# EAGLE design mixer-board1 (EAGLE 9.6.2)
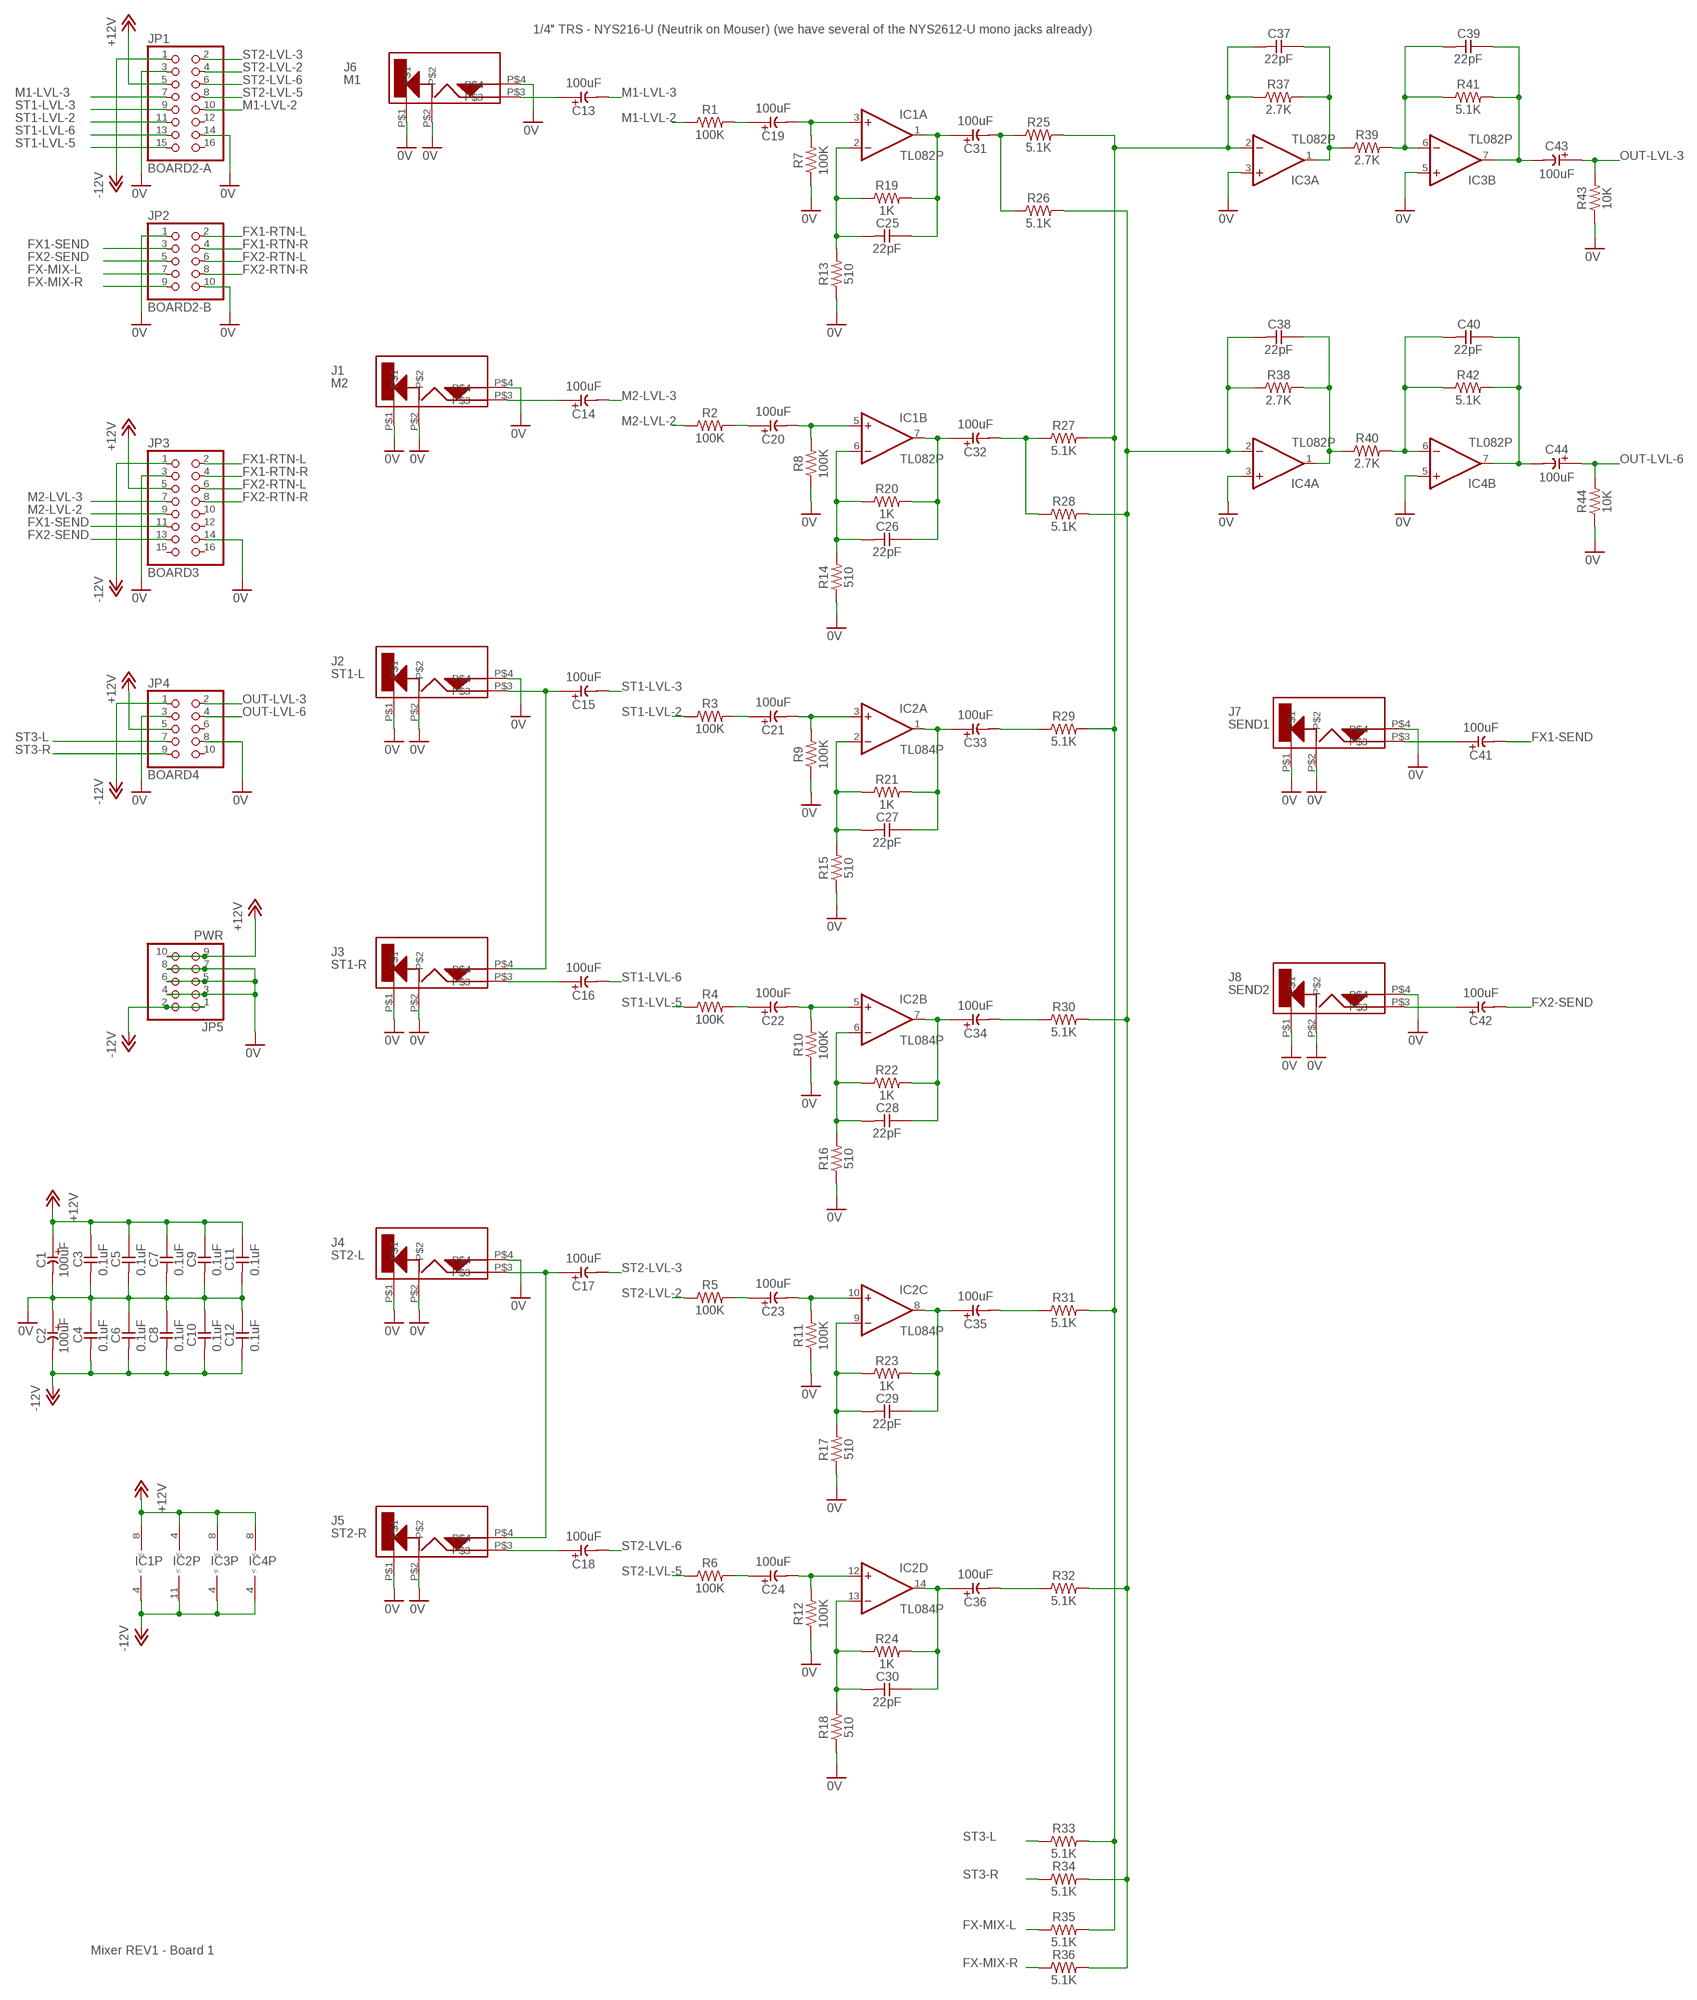
[diagram p0: schematic, sheet 1]

## Parts
C1  100uF  CE-USE5-8.5  [E5-8,5]
C2  100uF  CE-USE5-8.5  [E5-8,5]
C3  0.1uF  CC-US025-024X044  [C025-024X044]
C4  0.1uF  CC-US025-024X044  [C025-024X044]
C5  0.1uF  CC-US025-024X044  [C025-024X044]
C6  0.1uF  CC-US025-024X044  [C025-024X044]
C7  0.1uF  CC-US025-024X044  [C025-024X044]
C8  0.1uF  CC-US025-024X044  [C025-024X044]
C9  0.1uF  CC-US025-024X044  [C025-024X044]
C10  0.1uF  CC-US025-024X044  [C025-024X044]
C11  0.1uF  CC-US025-024X044  [C025-024X044]
C12  0.1uF  CC-US025-024X044  [C025-024X044]
C13  100uF  CE-USE5-8.5  [E5-8,5]
C14  100uF  CE-USE5-8.5  [E5-8,5]
C15  100uF  CE-USE5-8.5  [E5-8,5]
C16  100uF  CE-USE5-8.5  [E5-8,5]
C17  100uF  CE-USE5-8.5  [E5-8,5]
C18  100uF  CE-USE5-8.5  [E5-8,5]
C19  100uF  CE-USE5-8.5  [E5-8,5]
C20  100uF  CE-USE5-8.5  [E5-8,5]
C21  100uF  CE-USE5-8.5  [E5-8,5]
C22  100uF  CE-USE5-8.5  [E5-8,5]
C23  100uF  CE-USE5-8.5  [E5-8,5]
C24  100uF  CE-USE5-8.5  [E5-8,5]
C25  22pF  CC-US025-024X044  [C025-024X044]
C26  22pF  CC-US025-024X044  [C025-024X044]
C27  22pF  CC-US025-024X044  [C025-024X044]
C28  22pF  CC-US025-024X044  [C025-024X044]
C29  22pF  CC-US025-024X044  [C025-024X044]
C30  22pF  CC-US025-024X044  [C025-024X044]
C31  100uF  CE-USE5-8.5  [E5-8,5]
C32  100uF  CE-USE5-8.5  [E5-8,5]
C33  100uF  CE-USE5-8.5  [E5-8,5]
C34  100uF  CE-USE5-8.5  [E5-8,5]
C35  100uF  CE-USE5-8.5  [E5-8,5]
C36  100uF  CE-USE5-8.5  [E5-8,5]
C37  22pF  CC-US025-024X044  [C025-024X044]
C38  22pF  CC-US025-024X044  [C025-024X044]
C39  22pF  CC-US025-024X044  [C025-024X044]
C40  22pF  CC-US025-024X044  [C025-024X044]
C41  100uF  CE-USE5-8.5  [E5-8,5]
C42  100uF  CE-USE5-8.5  [E5-8,5]
C43  100uF  CE-USE5-8.5  [E5-8,5]
C44  100uF  CE-USE5-8.5  [E5-8,5]
IC1  TL082P  [DIL08]
IC2  TL084P  [DIL14]
IC3  TL082P  [DIL08]
IC4  TL082P  [DIL08]
J1  M2  CL1384  [CL1384]
J2  ST1-L  CL1384  [CL1384]
J3  ST1-R  CL1384  [CL1384]
J4  ST2-L  CL1384  [CL1384]
J5  ST2-R  CL1384  [CL1384]
J6  M1  CL1384  [CL1384]
J7  SEND1  CL1384  [CL1384]
J8  SEND2  CL1384  [CL1384]
JP1  BOARD2-A  PINHD-2X8  [2X08]
JP2  BOARD2-B  PINHD-2X5  [2X05]
JP3  BOARD3  PINHD-2X8  [2X08]
JP4  BOARD4  PINHD-2X5  [2X05]
JP5  PWR  PINHD-2X5  [2X05]
R1  100K  R  [0207/7]
R2  100K  R  [0207/7]
R3  100K  R  [0207/7]
R4  100K  R  [0207/7]
R5  100K  R  [0207/7]
R6  100K  R  [0207/7]
R7  100K  R  [0207/7]
R8  100K  R  [0207/7]
R9  100K  R  [0207/7]
R10  100K  R  [0207/7]
R11  100K  R  [0207/7]
R12  100K  R  [0207/7]
R13  510  R  [0207/7]
R14  510  R  [0207/7]
R15  510  R  [0207/7]
R16  510  R  [0207/7]
R17  510  R  [0207/7]
R18  510  R  [0207/7]
R19  1K  R  [0207/7]
R20  1K  R  [0207/7]
R21  1K  R  [0207/7]
R22  1K  R  [0207/7]
R23  1K  R  [0207/7]
R24  1K  R  [0207/7]
R25  5.1K  R  [0207/7]
R26  5.1K  R  [0207/7]
R27  5.1K  R  [0207/7]
R28  5.1K  R  [0207/7]
R29  5.1K  R  [0207/7]
R30  5.1K  R  [0207/7]
R31  5.1K  R  [0207/7]
R32  5.1K  R  [0207/7]
R33  5.1K  R  [0207/7]
R34  5.1K  R  [0207/7]
R35  5.1K  R  [0207/7]
R36  5.1K  R  [0207/7]
R37  2.7K  R  [0207/7]
R38  2.7K  R  [0207/7]
R39  2.7K  R  [0207/7]
R40  2.7K  R  [0207/7]
R41  5.1K  R  [0207/7]
R42  5.1K  R  [0207/7]
R43  10K  R  [0207/7]
R44  10K  R  [0207/7]

## Nets
0V [power]: C1.- C2.+ C3.2 C4.1 C5.2 C6.1 C7.2 C8.1 C9.2 C10.1 C11.2 C12.1 IC3.3(A:+IN) IC3.5(B:+IN) IC4.3(A:+IN) IC4.5(B:+IN) J1.P$1 J1.P$2 J1.P$4 J2.P$1 J2.P$2 J2.P$4 J3.P$1 J3.P$2 J4.P$1 J4.P$2 J4.P$4 J5.P$1 J5.P$2 J6.P$1 J6.P$2 J6.P$4 J7.P$1 J7.P$2 J7.P$4 J8.P$1 J8.P$2 J8.P$4 JP1.3 JP1.14 JP2.1 JP2.10 JP3.3 JP3.14 JP4.3 JP4.8 JP5.3 JP5.4 JP5.5 JP5.6 JP5.7 JP5.8 R7.1 R8.1 R9.1 R10.1 R11.1 R12.1 R13.1 R14.1 R15.1 R16.1 R17.1 R18.1 R43.1 R44.1
+12V [power]: C1.+ C3.1 C5.1 C7.1 C9.1 C11.1 IC1.8(P:V+) IC2.4(P:V+) IC3.8(P:V+) IC4.8(P:V+) JP1.5 JP3.5 JP4.5 JP5.9 JP5.10
-12V [power]: C2.- C4.2 C6.2 C8.2 C10.2 C12.2 IC1.4(P:V-) IC2.11(P:V-) IC3.4(P:V-) IC4.4(P:V-) JP1.1 JP3.1 JP4.1 JP5.1 JP5.2
FX1-RTN-L: JP2.2 JP3.2
FX1-RTN-R: JP2.4 JP3.4
FX1-SEND: C41.- JP2.3 JP3.11
FX2-RTN-L: JP2.6 JP3.6
FX2-RTN-R: JP2.8 JP3.8
FX2-SEND: C42.- JP2.5 JP3.13
FX-MIX-L: JP2.7 R35.1
FX-MIX-R: JP2.9 R36.1
M1-LVL-2: JP1.10 R1.1
M1-LVL-3: C13.- JP1.7
M2-LVL-2: JP3.9 R2.1
M2-LVL-3: C14.- JP3.7
N$1: C13.+ J6.P$3
N$2: C25.2 IC1.2(A:-IN) R13.2 R19.1
N$3: C19.- IC1.3(A:+IN) R7.2
N$4: C19.+ R1.2
N$5: C25.1 C31.+ IC1.1(A:OUT) R19.2
N$6: C31.- R25.1 R26.1
N$7: C37.2 IC3.2(A:-IN) R25.2 R27.2 R29.2 R31.2 R33.2 R35.2 R37.1
N$8: C37.1 IC3.1(A:OUT) R37.2 R39.1
N$9: C39.2 IC3.6(B:-IN) R39.2 R41.1
N$10: C32.- R27.1 R28.1
N$11: C38.1 IC4.1(A:OUT) R38.2 R40.1
N$12: C40.2 IC4.6(B:-IN) R40.2 R42.1
N$13: C39.1 C43.- IC3.7(B:OUT) R41.2
N$14: C42.+ J8.P$3
N$15: C38.2 IC4.2(A:-IN) R26.2 R28.2 R30.2 R32.2 R34.2 R36.2 R38.1
N$16: C14.+ J1.P$3
N$17: C15.+ J2.P$3 J3.P$4
N$18: C40.1 C44.- IC4.7(B:OUT) R42.2
N$19: C16.+ J3.P$3
N$20: C17.+ J4.P$3 J5.P$4
N$21: C18.+ J5.P$3
N$22: C26.1 C32.+ IC1.7(B:OUT) R20.2
N$23: C26.2 IC1.6(B:-IN) R14.2 R20.1
N$24: C20.- IC1.5(B:+IN) R8.2
N$25: C20.+ R2.2
N$27: C41.+ J7.P$3
N$28: C34.- R30.1
N$29: C33.- R29.1
N$30: C27.1 C33.+ IC2.1(A:OUT) R21.2
N$31: C27.2 IC2.2(A:-IN) R15.2 R21.1
N$32: C21.- IC2.3(A:+IN) R9.2
N$33: C21.+ R3.2
N$35: C28.1 C34.+ IC2.7(B:OUT) R22.2
N$36: C28.2 IC2.6(B:-IN) R16.2 R22.1
N$37: C22.- IC2.5(B:+IN) R10.2
N$38: C22.+ R4.2
N$41: C35.- R31.1
N$42: C29.1 C35.+ IC2.8(C:OUT) R23.2
N$43: C29.2 IC2.9(C:-IN) R17.2 R23.1
N$44: C23.- IC2.10(C:+IN) R11.2
N$45: C23.+ R5.2
N$48: C36.- R32.1
N$49: C30.1 C36.+ IC2.14(D:OUT) R24.2
N$50: C30.2 IC2.13(D:-IN) R18.2 R24.1
N$51: C24.- IC2.12(D:+IN) R12.2
N$52: C24.+ R6.2
OUT-LVL-3: C43.+ JP4.2 R43.2
OUT-LVL-6: C44.+ JP4.4 R44.2
ST1-LVL-2: JP1.11 R3.1
ST1-LVL-3: C15.- JP1.9
ST1-LVL-5: JP1.15 R4.1
ST1-LVL-6: C16.- JP1.13
ST2-LVL-2: JP1.4 R5.1
ST2-LVL-3: C17.- JP1.2
ST2-LVL-5: JP1.8 R6.1
ST2-LVL-6: C18.- JP1.6
ST3-L: JP4.7 R33.1
ST3-R: JP4.9 R34.1
Unconnected: JP1.12 JP1.16 JP3.10 JP3.12 JP3.15 JP3.16 JP4.6 JP4.10

## Notes on the sheet
- 1/4" TRS - NYS216-U (Neutrik on Mouser) (we have several of the NYS2612-U mono jacks already)
- Mixer REV1 - Board 1

## Library data of the parts
C1 C2 C13-C24 C31-C36 C41-C44 = _common:CE-US: ELECTROLYTIC CAPACITOR, US symbol
C3-C12 = _common.v1:CC-US: CAPACITOR, US symbol
C25-C30 C37-C40 = _common:CC-US: CAPACITOR, US symbol
IC1 IC3 IC4 = _common:TL082: OP AMP
IC2 = _common:TL084: OP AMP
J1-J8 = jacks:CL1384
JP1 JP3 = pinhead:PINHD-2X8: PIN HEADER
JP2 JP4 JP5 = pinhead:PINHD-2X5: PIN HEADER
R1-R44 = _common:R: RESISTOR, US symbol

## Net classes
0 default: width 0.305 mm, clearance 0.305 mm
1 power: width 0.711 mm, clearance 0.305 mm

## Board
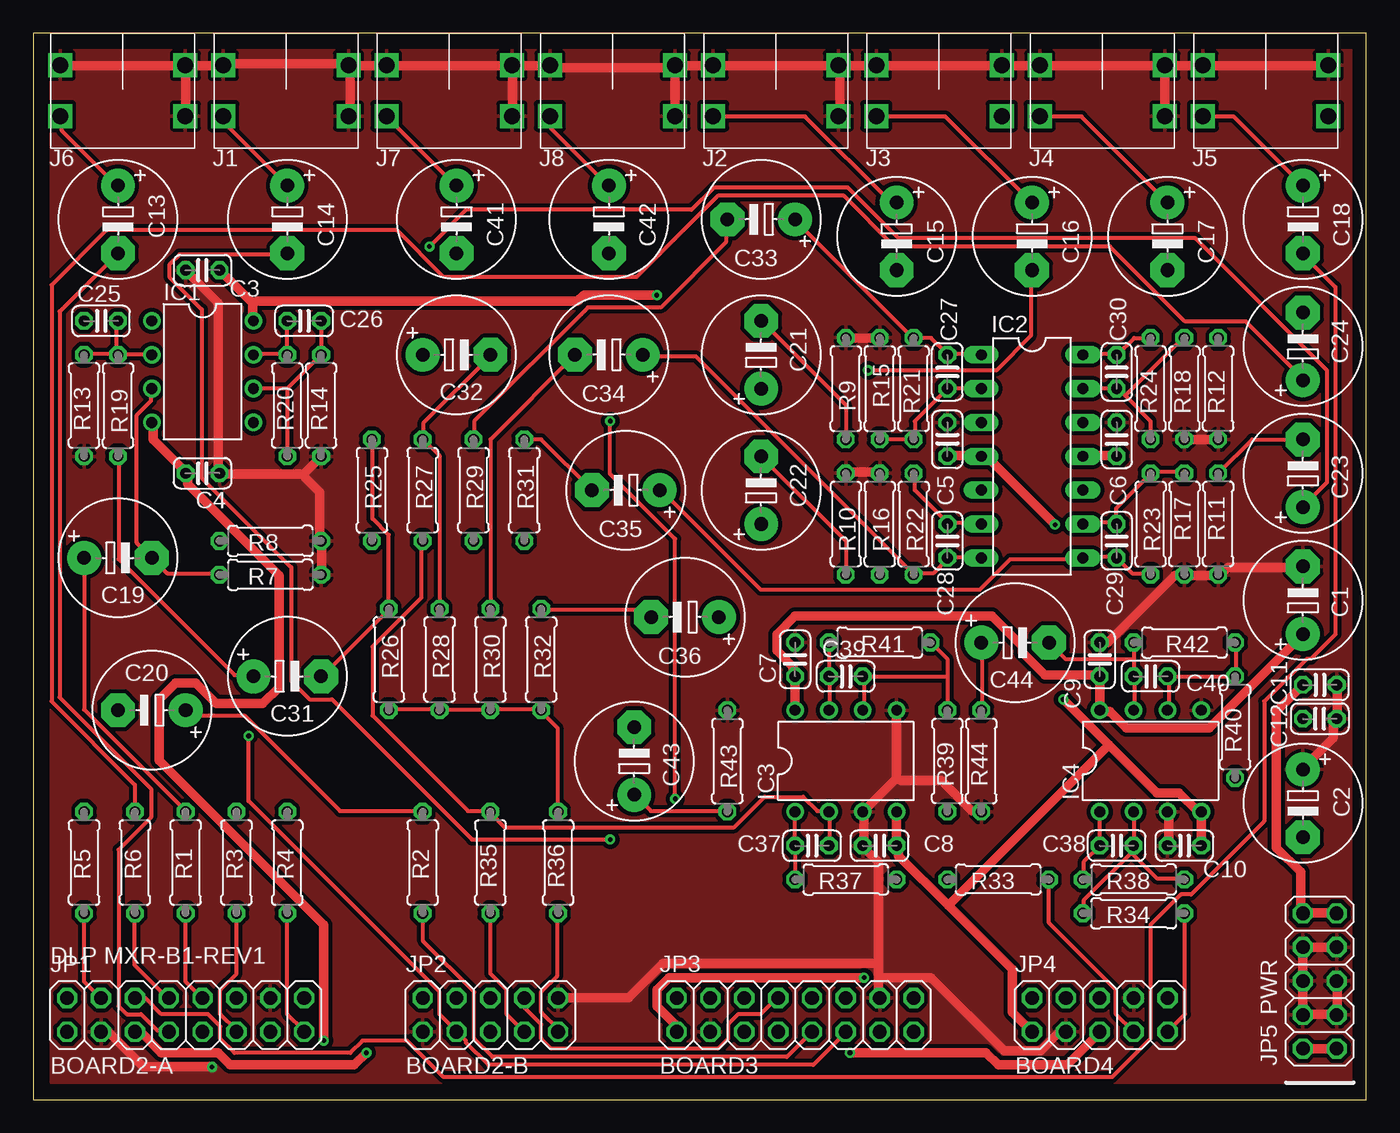
[diagram p1: board, top side]
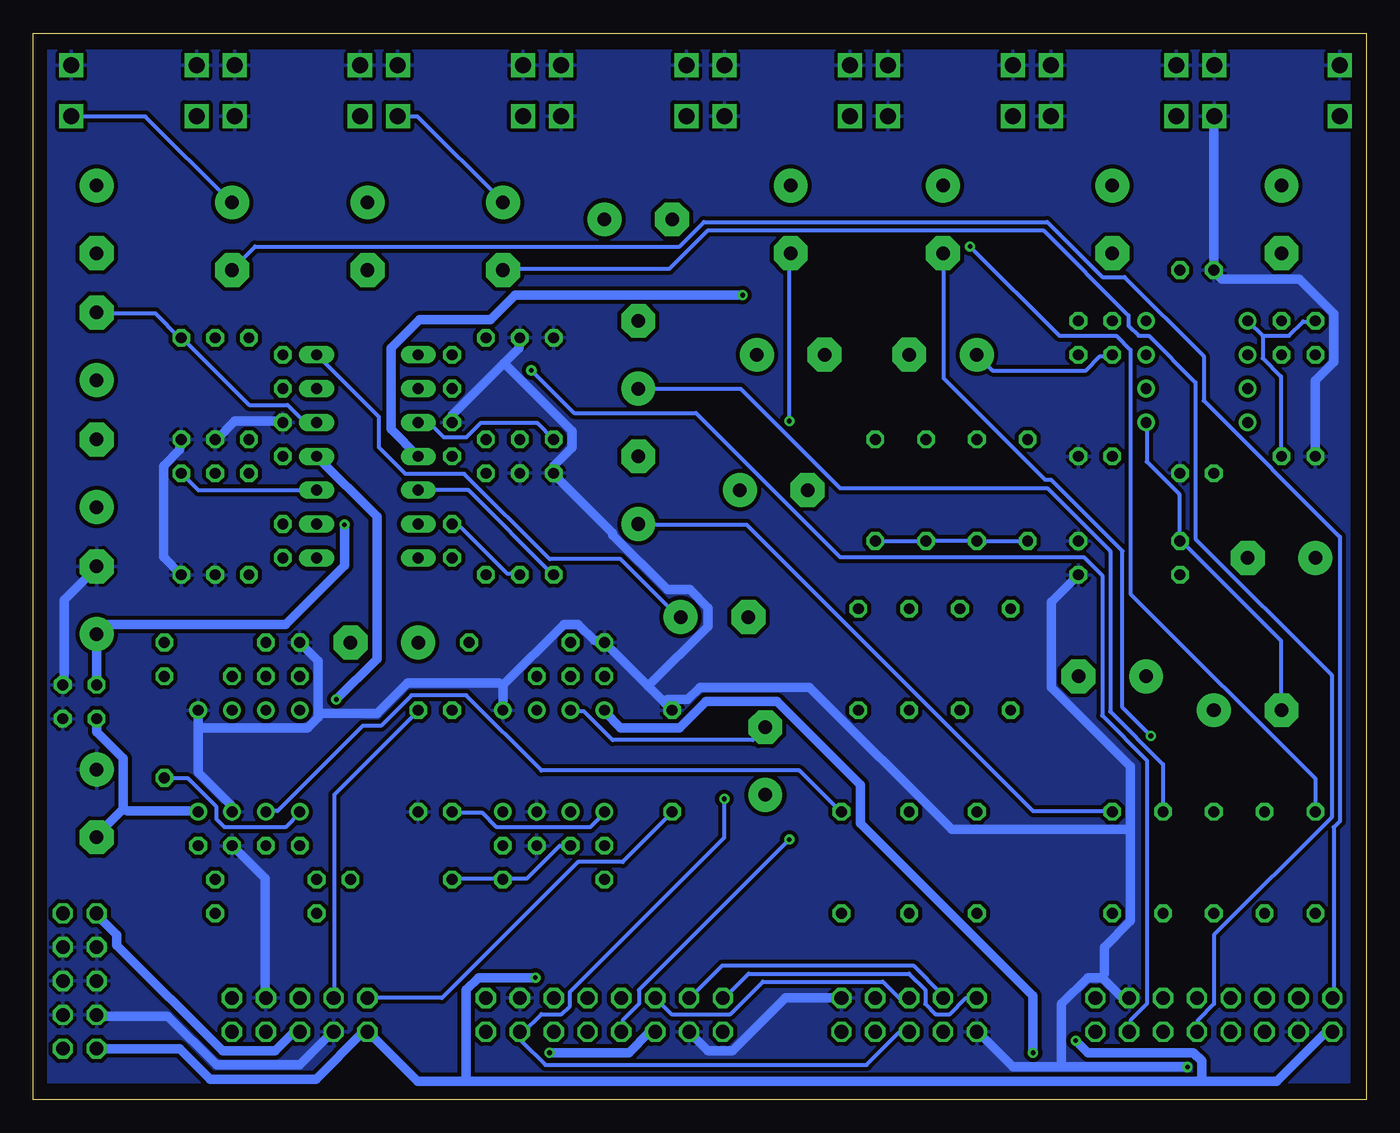
[diagram p2: board, bottom side, seen from below]

Size 100 x 80 mm. Coordinates in mm from the lower left corner, seen from the top.
Outline: 0,0 100,0 100,80 0,80 0,0
Copper layers (1*16): Top 0.035mm / dielectric 1.5mm / Bottom 0.035mm
Design rules "default": minimum track width 6mil, minimum drill 0.35mm, track to track 6mil, track to pad 6mil, pad to pad 6mil, via to via 6mil, smd to smd 6mil, copper to edge 40mil, drill to drill 6mil, minimum pad ring 10mil, minimum via ring 8mil, stop-mask expansion 4mil, vias tented up to drill 0mil, thermal gap 10mil

### Footprints (pad centres in the part's own frame; a part is rotated, then mirrored left to right if it is on the bottom)
E5-8,5 = drill 1.016 pad 2.54: + -2.54,0 | drill 1.016 pad 2.54 octagon: - 2.54,0
C025-024X044 = drill 0.813 octagon: 1 -1.27,0; 2 1.27,0
DIL08 = drill 0.813 pad 1.27: 1 -3.81,-3.81; 2 -1.27,-3.81; 3 1.27,-3.81; 4 3.81,-3.81; 5 3.81,3.81; 6 1.27,3.81; 7 -1.27,3.81; 8 -3.81,3.81
DIL14 = drill 0.813 long: 1 -7.62,-3.81; 2 -5.08,-3.81; 3 -2.54,-3.81; 4 0,-3.81; 5 2.54,-3.81; 6 5.08,-3.81; 7 7.62,-3.81; 8 7.62,3.81; 9 5.08,3.81; 10 2.54,3.81; 11 0,3.81; 12 -2.54,3.81; 13 -5.08,3.81; 14 -7.62,3.81
CL1384 = drill 1.2 square: P$1 0,0; P$2 9.4,0; P$3 0,-3.8; P$4 9.4,-3.8
2X08 = drill 1.016 octagon: 1 -8.89,-1.27; 2 -8.89,1.27; 3 -6.35,-1.27; 4 -6.35,1.27; 5 -3.81,-1.27; 6 -3.81,1.27; 7 -1.27,-1.27; 8 -1.27,1.27; 9 1.27,-1.27; 10 1.27,1.27; 11 3.81,-1.27; 12 3.81,1.27; 13 6.35,-1.27; 14 6.35,1.27; 15 8.89,-1.27; 16 8.89,1.27
2X05 = drill 1.016 octagon: 1 -5.08,-1.27; 2 -5.08,1.27; 3 -2.54,-1.27; 4 -2.54,1.27; 5 0,-1.27; 6 0,1.27; 7 2.54,-1.27; 8 2.54,1.27; 9 5.08,-1.27; 10 5.08,1.27
0207/7 = drill 0.813 octagon: 1 -3.81,0; 2 3.81,0

### Placement (x,y rotation side)
C1  95.25,37.47 90 top
C2  95.25,22.23 270 top
C3  12.7,62.23 180 top
C4  12.7,46.99 180 top
C5  68.58,49.53 90 top
C6  81.28,49.53 270 top
C7  57.15,33.02 90 top
C8  63.5,19.05 0 top
C9  80.01,33.02 90 top
C10  86.36,19.05 0 top
C11  96.52,31.11 0 top
C12  96.52,28.57 180 top
C13  6.35,66.04 270 top
C14  19.05,66.04 270 top
C15  64.77,64.77 270 top
C16  74.93,64.77 270 top
C17  85.09,64.77 270 top
C18  95.25,66.04 270 top
C19  6.35,40.64 0 top
C20  8.89,29.21 180 top
C21  54.61,55.88 90 top
C22  54.61,45.72 90 top
C23  95.25,46.99 90 top
C24  95.25,56.52 90 top
C25  5.08,58.42 0 top
C26  20.32,58.42 0 top
C27  68.58,54.61 270 top
C28  68.58,41.91 90 top
C29  81.28,41.91 90 top
C30  81.28,54.61 270 top
C31  19.05,31.75 0 top
C32  31.75,55.88 0 top
C33  54.61,66.04 180 top
C34  43.18,55.88 180 top
C35  44.45,45.72 180 top
C36  48.9,36.2 180 top
C37  58.42,19.05 0 top
C38  81.28,19.05 0 top
C39  60.96,31.75 0 top
C40  83.82,31.75 0 top
C41  31.75,66.04 270 top
C42  43.18,66.04 270 top
C43  45.09,25.4 90 top
C44  73.66,34.29 0 top
IC1  12.7,54.61 270 top
IC2  74.93,48.26 270 top
IC3  60.96,25.4 0 top
IC4  83.82,25.4 0 top
J1  14.25,77.6 0 top
J2  51,77.6 0 top
J3  63.25,77.6 0 top
J4  75.5,77.6 0 top
J5  87.75,77.6 0 top
J6  2,77.6 0 top
J7  26.5,77.6 0 top
J8  38.75,77.6 0 top
JP1  11.43,6.35 0 top
JP2  34.29,6.35 0 top
JP3  57.15,6.35 0 top
JP4  80.01,6.35 0 top
JP5  96.52,8.89 90 top
R1  11.43,17.78 90 top
R2  29.21,17.78 90 top
R3  15.24,17.78 90 top
R4  19.05,17.78 90 top
R5  3.81,17.78 90 top
R6  7.62,17.78 90 top
R7  17.78,39.37 180 top
R8  17.78,41.91 180 top
R9  60.96,53.34 270 top
R10  60.96,43.18 270 top
R11  88.9,43.18 90 top
R12  88.9,53.34 90 top
R13  3.81,52.07 90 top
R14  21.59,52.07 90 top
R15  63.5,53.34 270 top
R16  63.5,43.18 270 top
R17  86.36,43.18 90 top
R18  86.36,53.34 90 top
R19  6.35,52.07 270 top
R20  19.05,52.07 90 top
R21  66.04,53.34 90 top
R22  66.04,43.18 270 top
R23  83.82,43.18 270 top
R24  83.82,53.34 90 top
R25  25.4,45.72 270 top
R26  26.67,33.02 270 top
R27  29.21,45.72 270 top
R28  30.48,33.02 270 top
R29  33.02,45.72 270 top
R30  34.29,33.02 270 top
R31  36.83,45.72 270 top
R32  38.1,33.02 270 top
R33  72.39,16.51 180 top
R34  82.55,13.97 180 top
R35  34.29,17.78 90 top
R36  39.37,17.78 90 top
R37  60.96,16.51 180 top
R38  82.55,16.51 180 top
R39  68.58,25.4 90 top
R40  90.17,27.94 90 top
R41  63.5,34.29 180 top
R42  86.36,34.29 180 top
R43  52.07,25.4 270 top
R44  71.12,25.4 90 top

### Tracks (layer width: path | path; a pad name or v marks a point on that pad's centre or on a via)
0V  (via drill 0.35)
  Top 0.711: C10.1 85.19,19.05 85.19,21.49 IC4.3 | C11.2 97.84,31.09 97.84,28.65 C12.1 97.54,28.35 97.54,27.13 95.25,24.84 C2.+ | R12.1 R18.1 | C9.2 80.62,34.29 85.65,39.32 86.26,39.32 R17.1 86.72,39.32 88.85,39.32 R11.1 89.15,39.47 89.61,39.93 95.25,39.93 C1.- | R10.1 60.96,47.09 63.4,47.09 R16.1 | R15.1 R9.1 | JP5.5 97.84,8.84 97.84,6.71 JP5.3 97.69,6.4 95.56,6.4 JP5.4 JP5.6 JP5.8 JP5.7 | 64.77,24.08 IC3.5 | 64.77,24.08 62.48,21.79 IC3.3 62.33,21.49 62.33,19.05 C8.1 62.48,18.75 63.4,17.83 63.4,10.21 | R44.1 71.02,21.64 70.41,21.64 68.12,23.93 65.08,23.93 64.77,24.08 | 63.4,10.21 63.4,9.14 | 63.4,9.14 63.4,7.62 JP3.14 | 63.4,9.14 67.36,9.14 72.85,3.66 75.59,3.66 76.96,5.03 77.42,5.03 JP4.3 | JP2.10 44.65,7.62 47.24,10.21 63.4,10.21 | v13.41,2.44 8.23,2.44 5.64,5.03 5.18,5.03 JP1.3 | R7.1 21.64,39.47 21.64,41.91 R8.1 21.49,42.22 21.49,45.57 20.42,46.63 20.27,46.94 | 20.27,46.94 14.02,46.94 C4.1 13.87,47.24 13.87,59.74 11.43,62.18 C3.2 | R14.1 20.27,46.94 | J4.P$4 84.89,73.91 84.89,77.57 J4.P$2 | J4.P$2 85.19,77.57 87.63,77.57 J5.P$1 88.09,77.57 97.08,77.57 J5.P$2 | J4.P$2 84.58,77.57 75.74,77.57 J4.P$1 75.44,77.57 72.69,77.57 J3.P$2 72.39,77.57 63.55,77.57 J3.P$1 63.25,77.57 60.81,77.57 J2.P$2 | J8.P$4 48.16,73.91 48.16,77.57 J8.P$2 | J8.P$2 48.46,77.57 50.9,77.57 J2.P$1 51.36,77.57 60.05,77.57 J2.P$2 | J2.P$4 60.5,73.91 60.5,77.57 J2.P$2 | J7.P$4 35.97,73.91 35.97,77.57 J7.P$2 | J7.P$2 36.27,77.57 38.71,77.57 J8.P$1 39.01,77.42 47.85,77.42 J8.P$2 | J1.P$4 23.77,73.91 23.77,77.57 J1.P$2 | J1.P$2 24.08,77.57 26.36,77.57 J7.P$1 26.82,77.57 35.66,77.57 J7.P$2 | J6.P$4 11.43,73.91 11.43,77.57 J6.P$2
  Top 0.711: J6.P$1 2.13,77.57 11.12,77.57 J6.P$2 | J6.P$2 11.73,77.57 14.17,77.57 J1.P$1 14.48,77.72 23.32,77.72 J1.P$2
  Bottom 0.711: 87.63,27.89 87.63,24.54 85.19,22.1 85.19,21.64 IC4.3 | 87.63,27.89 IC4.5 | JP4.8 82.6,7.62 82.6,16.61 85.04,19.05 C10.1 | C6.1 81.38,50.9 84.89,50.9 86.26,49.53 R18.1 | R11.1 90.22,40.69 90.22,47.55 89,48.77 89,49.53 R12.1 | C11.2 97.69,31.24 97.69,37.49 95.25,39.93 C1.- | 87.63,27.89 79.4,27.89 78.64,28.65 78.64,28.96 | 78.64,28.96 78.64,32.92 C9.2 | C5.2 68.58,51.36 64.69,55.24 | 64.69,55.24 63.55,56.39 63.55,57.15 R15.1 | 64.69,55.24 59.59,50.14 59.59,48.92 60.96,47.55 R10.1 60.81,46.79 56.54,42.52 56.54,42.37 52.43,38.25 50.75,38.25 49.38,36.88 49.38,35.51 53.87,31.01 | JP2.10 43.59,7.62 47.55,3.66 49.38,3.66 JP3.3 | 53.87,31.01 C7.2 57.45,34.44 57.91,34.44 59.13,35.66 60.2,35.66 64.77,31.09 | 53.87,31.01 52.65,29.79 | 52.65,29.79 R43.1 | JP5.4 95.25,6.25 89.92,6.25 86.26,2.59 80.01,2.59 77.57,5.03 JP4.3 | IC3.5 64.77,31.09 | 78.64,28.96 74.22,28.96 71.93,31.24 65.08,31.24 64.77,31.09 | 22.86,2.44 26.52,2.44 29.11,5.03 JP2.1 | 22.86,2.44 v13.41,2.44 | JP1.14 18.29,7.62 19.81,9.14 | 19.81,9.14 20.88,9.14 22.86,7.16 22.86,2.44 | R13.1 3.81,53.95 2.44,55.32 2.44,58.98 5.03,61.57 10.82,61.57 11.43,62.18 C3.2 11.43,73.76 J6.P$4 | 17.68,20.27 17.68,24.99 23.62,30.94 23.62,37.34 R7.1 | 17.68,20.27 17.68,13.41 19.66,11.43 19.66,9.45 19.81,9.14 | 17.68,20.27 31.09,20.27 41.76,30.94 49.99,30.94 50.9,30.02 52.43,30.02 52.65,29.79
  pour Top: 1.27,1.27 99.06,1.27 99.06,78.74 1.27,78.74
  pour Bottom: 1.27,1.27 99.06,1.27 99.06,78.74 1.27,78.74
+12V  (via drill 0.35)
  Top 0.711: IC3.8 C7.1 57,32 57,32.46 55.78,33.68 55.78,34.9 57.15,36.27 71.93,36.27 74.22,33.98 74.22,33.53 75.89,31.85 79.7,31.85 C9.1 IC4.8 80.31,29.11 80.77,29.11 81.99,27.89 88.24,27.89 95.25,34.9 C1.+ | v24.99,3.5 24.08,2.59 14.78,2.59 13.87,3.5 9.6,3.5 8.08,5.03 7.62,5.03 JP1.5 | v61.27,3.5 71.48,3.5 72.39,2.59 77.57,2.59 80.01,5.03 JP4.5 | 16.46,59.74 16.46,58.52 IC1.8 | C3.1 16.46,59.74 | JP5.9 97.69,14.02 95.25,14.02 JP5.10 95.1,14.33 95.1,17.07 93.27,18.9 93.27,29.11 95.25,31.09 C11.1 | C5.1 68.58,48.31 71.02,48.31 IC2.4 71.48,48.31 v76.66,43.13 | v46.79,60.35 41.3,60.35 40.84,59.89 16.76,59.89 16.46,59.74
  Bottom 0.711: v24.99,3.5 24.99,7.77 37.95,20.73 37.95,23.62 44.2,29.87 49.53,29.87 51.51,27.89 55.93,27.89 57.15,29.11 IC3.8 | v61.27,3.5 55.32,3.5 53.8,5.03 53.34,5.03 JP3.5 | C11.1 C1.+ 94.94,35.05 94.34,35.66 81.08,35.66 76.66,40.08 v76.66,43.13 | v46.79,60.35 63.86,60.35 65.68,58.52 71.02,58.52 73.15,56.39 73.15,50.29 IC2.4 | JP4.5 80.01,5.03 80.47,5.03 81.84,3.66 85.8,3.66 93.73,11.58 93.73,12.34 95.25,13.87 JP5.10
-12V  (via drill 0.35)
  Top 0.711: IC2.11 78.79,48.31 81.23,48.31 C6.2 | C10.2 IC4.4 87.33,21.64 85.95,23.01 84.28,23.01 80.7,26.59 | 80.7,26.59 v77.27,30.02 | IC1.4 8.99,50.75 8.99,49.53 11.43,47.09 C4.2 11.58,46.79 11.58,46.18 18.44,39.32 18.44,30.94 17.22,29.72 13.72,29.72 12.19,31.24 10.67,31.24 9.45,30.02 9.45,25.45 21.79,13.11 v21.79,4.42 | JP5.1 JP5.2 | IC3.4 C8.2 64.92,18.75 64.92,18.29 68.66,14.55 | v62.33,9.14 47.7,9.14 46.79,8.23 46.79,7.01 48.16,5.64 48.16,5.18 JP3.1 | 68.66,14.55 73.46,9.75 73.46,6.55 JP4.1 | 68.66,14.55 80.7,26.59
  Bottom 0.711: C12.2 95.25,27.58 93.27,25.6 93.27,21.79 | 93.27,21.79 95.25,19.81 C2.- | IC4.4 87.63,21.64 92.96,21.64 93.27,21.79 | IC2.11 74.22,43.74 74.22,33.07 v77.27,30.02 | 67.51,1.37 71.17,1.37 74.83,5.03 JP4.1 75.29,5.03 78.79,1.52 86.72,1.52 89,3.81 JP5.2 | 67.51,1.37 12.34,1.37 | 12.34,1.37 6.71,1.37 3.05,5.03 2.59,5.03 JP1.1 | v62.33,9.14 66.6,9.14 67.51,8.23 67.51,1.37 | v21.79,4.42 20.88,3.5 12.95,3.5 12.34,2.9 12.34,1.37
FX1-RTN-L
  Bottom 0.305: JP2.2 30.02,7.62 31.24,6.4 32.31,6.4 33.07,7.16 33.07,8.23 34.29,9.45 46.33,9.45 48.16,7.62 JP3.2
FX1-RTN-R
  Bottom 0.305: JP2.4 31.85,7.62 31.85,7.92 33.98,10.06 48.31,10.06 50.75,7.62 JP3.4
FX1-SEND  (via drill 0.35)
  Top 0.305: JP3.11 60.96,5.03 58.52,2.59 34.14,2.59 32.46,4.27 32.46,4.42 31.85,5.03 JP2.3 31.7,5.18 30.48,6.4 30.48,8.08 16.15,22.4 v16.15,27.28
  Bottom 0.305: v16.15,27.28 18.29,29.41 18.29,41.15 23.62,46.48 24.08,46.48 31.7,54.1 31.7,63.4 C41.-
FX2-RTN-L
  Bottom 0.305: JP2.6 35.05,7.62 36.27,8.84 45.26,8.84 47.7,6.4 52.12,6.4 JP3.6
FX2-RTN-R
  Top 0.305: JP2.8 36.88,7.62 36.88,6.86 38.1,5.64 38.1,4.57 38.86,3.81 51.36,3.81 52.12,4.57 52.12,5.64 52.88,6.4 54.56,6.4 55.78,7.62 JP3.8
FX2-SEND  (via drill 0.35)
  Top 0.305: v43.28,50.9 43.28,46.94 48.16,42.06 v48.16,22.55
  Bottom 0.305: JP2.5 34.29,5.03 35.05,5.03 37.49,2.59 61.57,2.59 63.4,4.42 63.4,5.03 JP3.13 63.25,5.03 61.87,6.4 60.35,6.4 59.74,7.01 59.74,8.08 48.16,19.66 v48.16,22.55 | v43.28,50.9 43.28,63.4 C42.-
FX-MIX-L
  Top 0.305: R35.1 34.29,9.45 35.51,8.23 35.51,6.4 JP2.7
FX-MIX-R
  Top 0.305: R36.1 39.32,13.87 39.32,9.3 38.1,8.08 38.1,6.55 39.47,5.18 JP2.9
M1-LVL-2
  Top 0.305: R1.1 11.43,8.84 12.65,7.62 JP1.10
M1-LVL-3
  Top 0.305: C13.- 1.98,59.13 1.98,30.18 8.84,23.32 8.84,21.18 6.4,18.75 6.4,7.01 7.01,6.4 8.08,6.4 9.3,5.18 10.06,5.18 JP1.7
M2-LVL-2
  Top 0.305: JP3.9 56.54,3.2 34.44,3.2 33.07,4.57 33.07,8.08 29.26,11.89 29.26,13.87 R2.1
M2-LVL-3  (via drill 0.35)
  Top 0.305: v43.28,19.51 32.92,19.51 22.4,30.02 20.73,30.02 19.36,31.39 19.36,39.93 12.65,46.63 12.65,59.28 10.21,61.72 10.21,62.64 10.97,63.4 19.05,63.4 C14.-
  Bottom 0.305: v43.28,19.51 54.56,8.23 54.56,7.16 55.78,5.94 55.78,5.18 JP3.7
N$1
  Top 0.305: J6.P$3 2.13,73.76 2.13,72.69 6.25,68.58 C13.+
N$2
  Top 0.305: R13.2 3.81,55.93 6.25,55.93 R19.1 | IC1.2 8.84,55.93 6.4,55.93 R19.1 | C25.2 6.25,58.37 6.25,56.08 R19.1
N$3
  Top 0.305: R7.2 13.87,39.47 10.06,39.47 C19.- 7.77,41.76 7.77,51.36 8.84,52.43 8.84,53.34 IC1.3
N$4
  Top 0.305: C19.+ 3.81,29.26 11.43,21.64 R1.2
N$5
  Top 0.305: C31.+ 16.46,31.85 15.09,31.85 6.4,40.54 6.4,48.16 R19.2
  Bottom 0.305: 7.77,57.3 7.77,55.63 6.4,54.25 6.4,48.31 R19.2 | IC1.1 7.77,57.3 | 7.77,57.3 5.79,57.3 4.72,58.37 3.81,58.37 C25.1
N$6
  Top 0.305: C31.- 21.64,31.7 26.67,36.73 R26.1 26.67,42.37 25.45,43.59 25.45,49.53 R25.1
N$7
  Top 0.305: C37.2 59.74,19.05 59.74,21.49 IC3.2 59.59,21.64 58.83,21.64 57.76,22.71 54.86,22.71 52.58,20.42 35.36,20.42 34.29,21.49 R35.2 34.29,21.64 32.61,21.64 25.45,28.8 25.45,33.98 29.11,37.64 29.11,41.91 R27.2
  Bottom 0.305: 64.77,16.61 68.58,16.61 R33.2 | C37.2 60.5,19.05 62.94,16.61 64.77,16.61 | 64.77,16.61 R37.1 | R31.2 R29.2 R27.2 R25.2
N$8
  Top 0.305: R37.2 C37.1 IC3.1
  Bottom 0.305: R39.1 68.58,21.49 66.29,21.49 65.23,20.42 58.22,20.42 57.15,21.49 IC3.1
N$9
  Top 0.305: IC3.6 62.33,29.26 62.33,31.7 C39.2 62.48,31.7 68.58,31.7 | 68.58,31.7 68.58,33.07 67.36,34.29 R41.1 | 68.58,31.7 R39.2
N$10
  Top 0.305: 29.26,49.53 29.26,50.75 34.29,55.78 C32.- | R28.1 30.48,48.31 29.26,49.53 | 29.26,49.53 R27.1
N$11
  Top 0.305: R38.2 78.79,16.61 78.79,17.83 C38.1 IC4.1
  Bottom 0.305: R40.1 90.07,24.08 88.39,24.08 86.26,21.95 86.26,21.03 85.65,20.42 81.08,20.42 80.01,21.49 IC4.1
N$12
  Top 0.305: IC4.6 85.19,29.26 85.19,31.7 C40.2 85.34,31.7 90.07,31.7 R40.2 90.22,31.85 90.22,34.29 R42.1
N$13
  Top 0.305: IC3.7 59.74,29.26 59.74,31.7 C39.1 59.74,31.85 59.74,34.29 R41.2
  Bottom 0.305: IC3.7 59.59,29.11 58.67,29.11 56.54,26.98 46.02,26.98 45.11,27.89 C43.-
N$14
  Top 0.305: J8.P$3 38.86,73.76 38.86,72.85 43.13,68.58 C42.+
N$15
  Top 0.305: R34.2 78.79,14.02 78.79,14.94 82.45,18.59 82.45,19.05 C38.2 | IC4.2 82.6,21.49 82.6,19.05 C38.2 | R38.1 86.26,16.61 84.28,16.61 82.45,18.44 C38.2 | 30.48,29.26 26.67,29.26 R26.2 | 30.48,29.26 34.29,29.26 | 30.48,29.26 R28.2 | R36.2 39.32,21.64 39.32,27.89 38.1,29.11 R32.2 38.1,29.26 34.29,29.26 | 34.29,29.26 R30.2
  Bottom 0.305: IC4.2 82.45,21.64 81.69,21.64 75.29,28.04 73.91,28.04 71.63,30.33 67.51,30.33 61.87,24.69 42.52,24.69 39.47,21.64 R36.2
N$16
  Top 0.305: C14.+ 14.33,73.3 14.33,73.76 J1.P$3
N$17
  Top 0.305: J2.P$3 51.05,73.76 57.91,73.76 64.31,67.36 64.77,67.36 C15.+
  Bottom 0.305: J3.P$4 72.54,73.76 71.17,73.76 64.77,67.36 C15.+
N$18
  Top 0.305: IC4.7 82.6,29.26 82.6,31.7 C40.1 82.6,31.85 82.6,33.07 | 82.6,33.07 82.6,34.29 R42.2 | 82.6,33.07 77.42,33.07 C44.-
N$19
  Top 0.305: J3.P$3 63.4,73.76 68.43,73.76 74.83,67.36 C16.+
N$20
  Top 0.305: C17.+ 78.64,73.76 75.59,73.76 J4.P$3
  Bottom 0.305: J5.P$4 97.08,73.76 91.59,73.76 85.19,67.36 C17.+
N$21
  Top 0.305: C18.+ 90.07,73.76 87.78,73.76 J5.P$3
N$22
  Top 0.305: 19.05,55.93 16.61,55.93 IC1.7 | 19.05,55.93 C26.1 | 19.05,55.93 R20.2
  Bottom 0.305: C32.+ 28.04,54.71 21.03,54.71 19.96,55.78 19.05,55.78 R20.2
N$23
  Top 0.305: 19.05,53.34 IC1.6 | 19.05,53.34 R14.2 21.64,55.93 21.64,58.37 C26.2 | 19.05,53.34 R20.1
N$24
  Bottom 0.305: IC1.5 16.46,50.75 16.46,47.85 14.02,45.41 14.02,41.91 R8.2 13.87,41.91 6.4,34.44 6.4,29.26 C20.-
N$25
  Top 0.305: R2.2 29.11,21.64 23.01,21.64 15.85,28.8 11.73,28.8 11.43,29.11 C20.+
N$27
  Top 0.305: J7.P$3 26.52,73.76 31.7,68.58 C41.+
N$28
  Top 0.305: R30.1 34.29,49.53 C34.-
N$29
  Top 0.305: R29.1 33.07,49.53 33.07,50.9 41.6,59.44 47.09,59.44 51.97,64.31 51.97,65.99 C33.-
N$30
  Top 0.305: 68.58,55.93 71.02,55.93 IC2.1 | 68.58,55.93 67.36,57.15 R21.2 65.99,57.15 57.15,65.99 C33.+ | 68.58,55.93 C27.1
N$31
  Top 0.305: R15.2 R21.1 66.14,49.53 66.14,50.9 C27.2 IC2.2
N$32
  Top 0.305: R9.2 60.96,52.12 54.71,58.37 C21.-
  Bottom 0.305: R9.2 62.18,50.75 66.45,50.75 67.51,49.68 69.19,49.68 70.26,50.75 71.02,50.75 IC2.3
N$33
  Bottom 0.305: R3.2 15.24,25.15 19.2,29.11 19.2,41.15 23.93,45.87 39.47,45.87 46.94,53.34 C21.+
N$35
  Top 0.305: IC2.7 71.02,40.69 68.58,40.69 C28.1 68.58,40.54 67.51,39.47 66.14,39.47 R22.2 65.99,39.47 49.68,55.78 45.72,55.78 C34.+
N$36
  Top 0.305: 68.58,43.28 66.14,45.72 66.14,46.94 R22.1 | 68.58,43.28 71.02,43.28 IC2.6 | 68.58,43.28 C28.2
  Bottom 0.305: R16.2 63.55,39.47 64.47,39.47 68.12,43.13 68.58,43.13 C28.2
N$37
  Top 0.305: R10.2 60.96,41.91 C22.-
  Bottom 0.305: IC2.5 67.36,45.72 60.96,39.32 R10.2
N$38
  Bottom 0.305: R4.2 19.05,21.64 24.99,21.64 46.48,43.13 54.56,43.13 C22.+
N$41
  Top 0.305: R31.1 38.1,49.53 C35.-
N$42
  Top 0.305: R23.2 83.82,39.47 82.45,39.47 C29.1 81.23,40.69 78.79,40.69 IC2.8 78.64,40.54 73.3,40.54 71.02,38.25 54.56,38.25 47.09,45.72 C35.+
N$43
  Top 0.305: IC2.9 78.79,43.28 81.23,43.28 C29.2 81.23,43.43 81.23,44.35 83.82,46.94 R23.1 83.82,47.09 86.26,47.09 R17.2
N$44
  Top 0.305: C23.- 91.44,49.53 R11.2
  Bottom 0.305: IC2.10 87.63,45.72 R11.2
N$45  (via drill 0.35)
  Top 0.305: v29.72,64.01 32.46,66.75 49.38,66.75 51.05,68.43 61.11,68.43 64.92,64.62 87.17,64.62 97.08,54.71 97.08,46.33 95.25,44.5 C23.+
  Bottom 0.305: R5.2 3.81,24.08 17.68,37.95 17.68,56.24 18.75,57.3 23.01,57.3 v29.72,64.01
N$48
  Top 0.305: R32.1 38.1,36.73 45.87,36.73 46.33,36.27 C36.-
N$49
  Top 0.305: IC2.14 78.79,55.93 81.23,55.93 C30.1 81.38,55.93 82.6,57.15 R24.2
  Bottom 0.305: IC2.14 74.07,51.21 74.07,48.92 72.08,46.94 67.67,46.94 61.27,40.54 55.93,40.54 51.51,36.12 C36.+
N$50
  Top 0.305: R24.1 83.82,50.9 81.92,52.81 | 81.92,52.81 81.38,53.34 C30.2 IC2.13 | 81.92,52.81 86.26,57.15 R18.2
N$51
  Bottom 0.305: IC2.12 78.79,50.9 79.7,50.9 80.92,52.12 83.82,52.12 88.85,57.15 R12.2 89,57.15 90.83,58.98 95.25,58.98 C24.-
N$52
  Top 0.305: R6.2 7.62,23.62 1.37,29.87 1.37,61.11 5.49,65.23 27.28,65.23 30.79,61.72 45.26,61.72 51.36,67.82 60.81,67.82 64.62,64.01 80.77,64.01 86.41,58.37 90.98,58.37 95.25,54.1 C24.+
OUT-LVL-3
  Top 0.305: R43.2 51.97,21.64 46.33,21.64 45.11,22.86 C43.+
  Bottom 0.305: JP4.2 69.34,7.62 59.13,17.83 55.78,17.83 52.12,21.49 R43.2
OUT-LVL-6
  Top 0.305: R44.2 71.17,29.26 71.17,34.29 C44.+
  Bottom 0.305: JP4.4 77.42,7.62 77.42,22.86 71.17,29.11 R44.2
ST1-LVL-2
  Top 0.305: R3.1 15.24,9.45 14.02,8.23 14.02,6.4 15.24,5.18 JP1.11
ST1-LVL-3
  Bottom 0.305: JP1.9 12.65,5.18 12.65,5.94 11.43,7.16 11.43,12.34 2.59,21.18 2.59,31.85 12.8,42.06 12.8,53.8 16.31,57.3 17.07,57.3 17.83,58.06 17.83,58.83 24.23,65.23 49.38,65.23 52.27,62.33 64.77,62.33 C15.-
ST1-LVL-5
  Top 0.305: R4.1 19.05,6.4 20.27,5.18 JP1.15
ST1-LVL-6  (via drill 0.35)
  Top 0.305: v62.64,54.71 72.24,54.71 74.83,57.3 74.83,62.18 C16.-
  Bottom 0.305: v62.64,54.71 59.44,51.51 50.29,51.51 39.47,40.69 21.18,40.69 19.81,39.32 19.81,28.8 16.46,25.45 16.46,7.16 17.68,5.94 17.68,5.18 JP1.13
ST2-LVL-2
  Top 0.305: R5.1 3.81,8.84 5.03,7.62 JP1.4
ST2-LVL-3
  Bottom 0.305: JP1.2 2.44,7.62 2.44,20.42 1.98,20.88 1.98,42.22 12.19,52.43 12.19,55.78 18.14,61.72 19.81,61.72 23.93,65.84 49.68,65.84 51.51,64.01 83.36,64.01 85.04,62.33 C17.-
ST2-LVL-5
  Top 0.305: R6.1 7.62,10.06 10.06,7.62 JP1.8
ST2-LVL-6
  Top 0.305: JP1.6 8.38,7.62 9.6,6.4 13.11,6.4 14.02,5.49 14.02,4.57 15.09,3.5 23.77,3.5 24.69,4.42 28.04,4.42 30.79,1.68 80.92,1.68 83.82,4.57 83.82,13.11 86.11,15.39 86.87,15.39 92.35,20.88 92.35,29.87 95.56,33.07 95.86,33.07 97.69,34.9 97.69,60.96 95.25,63.4 C18.-
ST3-L
  Top 0.305: R33.1 76.2,13.26 81.23,8.23 81.23,6.4 JP4.7
ST3-R
  Top 0.305: JP4.9 86.41,6.4 86.41,13.87 R34.1

### Text on the board
tNames: DLP MXR-B1-REV1 | PWR | BOARD2-A | BOARD2-B | BOARD3 | BOARD4